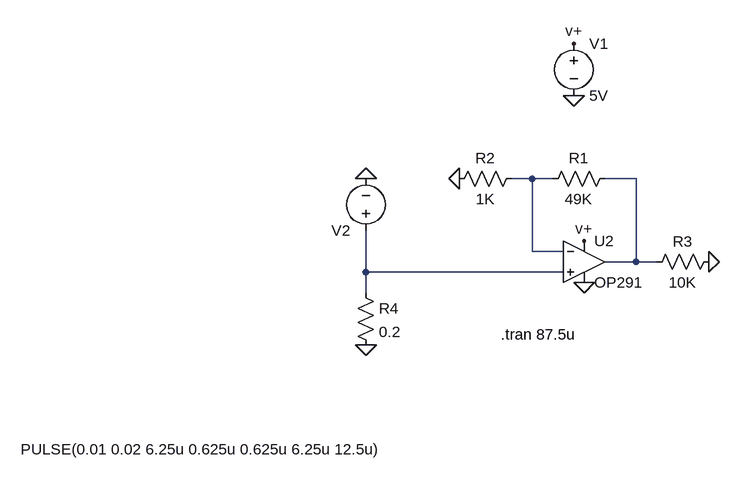
[diagram p0: schematic BandwidthTest.asc]
BandwidthTest.asc, the LTspice schematic file:
Version 4.1
SHEET 1 1048 764
WIRE 16 208 -16 208
WIRE 48 208 16 208
WIRE 176 208 128 208
WIRE 16 320 16 208
WIRE 64 320 16 320
WIRE 176 336 176 208
WIRE 176 336 128 336
WIRE 208 336 176 336
WIRE -240 352 -240 288
WIRE 64 352 -240 352
WIRE -240 384 -240 352
FLAG 80 80 0
FLAG 80 0 v+
FLAG -240 208 0
FLAG 288 336 0
FLAG -96 208 0
FLAG -240 464 0
FLAG 96 304 v+
FLAG 96 368 0
SYMBOL voltage 80 -16 R0
WINDOW 123 0 0 Left 0
WINDOW 39 0 0 Left 0
SYMATTR InstName V1
SYMATTR Value 5V
SYMBOL voltage -240 304 R180
WINDOW 3 -29 -321 Left 2
WINDOW 123 0 0 Left 0
WINDOW 39 0 0 Left 0
SYMATTR Value PULSE(0.01 0.02 6.25u 0.625u 0.625u 6.25u 12.5u)
SYMATTR InstName V2
SYMBOL res 144 192 R90
WINDOW 0 0 56 VBottom 2
WINDOW 3 32 56 VTop 2
SYMATTR InstName R1
SYMATTR Value 49K
SYMBOL res 0 192 R90
WINDOW 0 0 56 VBottom 2
WINDOW 3 32 56 VTop 2
SYMATTR InstName R2
SYMATTR Value 1K
SYMBOL res 304 320 R90
WINDOW 0 0 56 VBottom 2
WINDOW 3 32 56 VTop 2
SYMATTR InstName R3
SYMATTR Value 10K
SYMBOL res -256 368 R0
SYMATTR InstName R4
SYMATTR Value 0.2
SYMBOL OpAmps\\OP291 96 272 R0
SYMATTR InstName U2
TEXT -32 448 Left 2 !.tran 87.5u

The netlist it stands for:
* BandwidthTest.asc
V1 v+ 0 5V
V2 N003 0 PULSE(0.01 0.02 6.25u 0.625u 0.625u 6.25u 12.5u)
R1 N002 N001 49K
R2 N001 0 1K
R3 0 N002 10K
R4 N003 0 0.2
X§U2 N003 N001 v+ 0 N002 OP291  ; pins In+ In- V+ V- OUT
.tran 87.5u
.backanno
.end